# EAGLE schematic Mixer_schaltplan_2.12.23 (EAGLE 9.7.0)
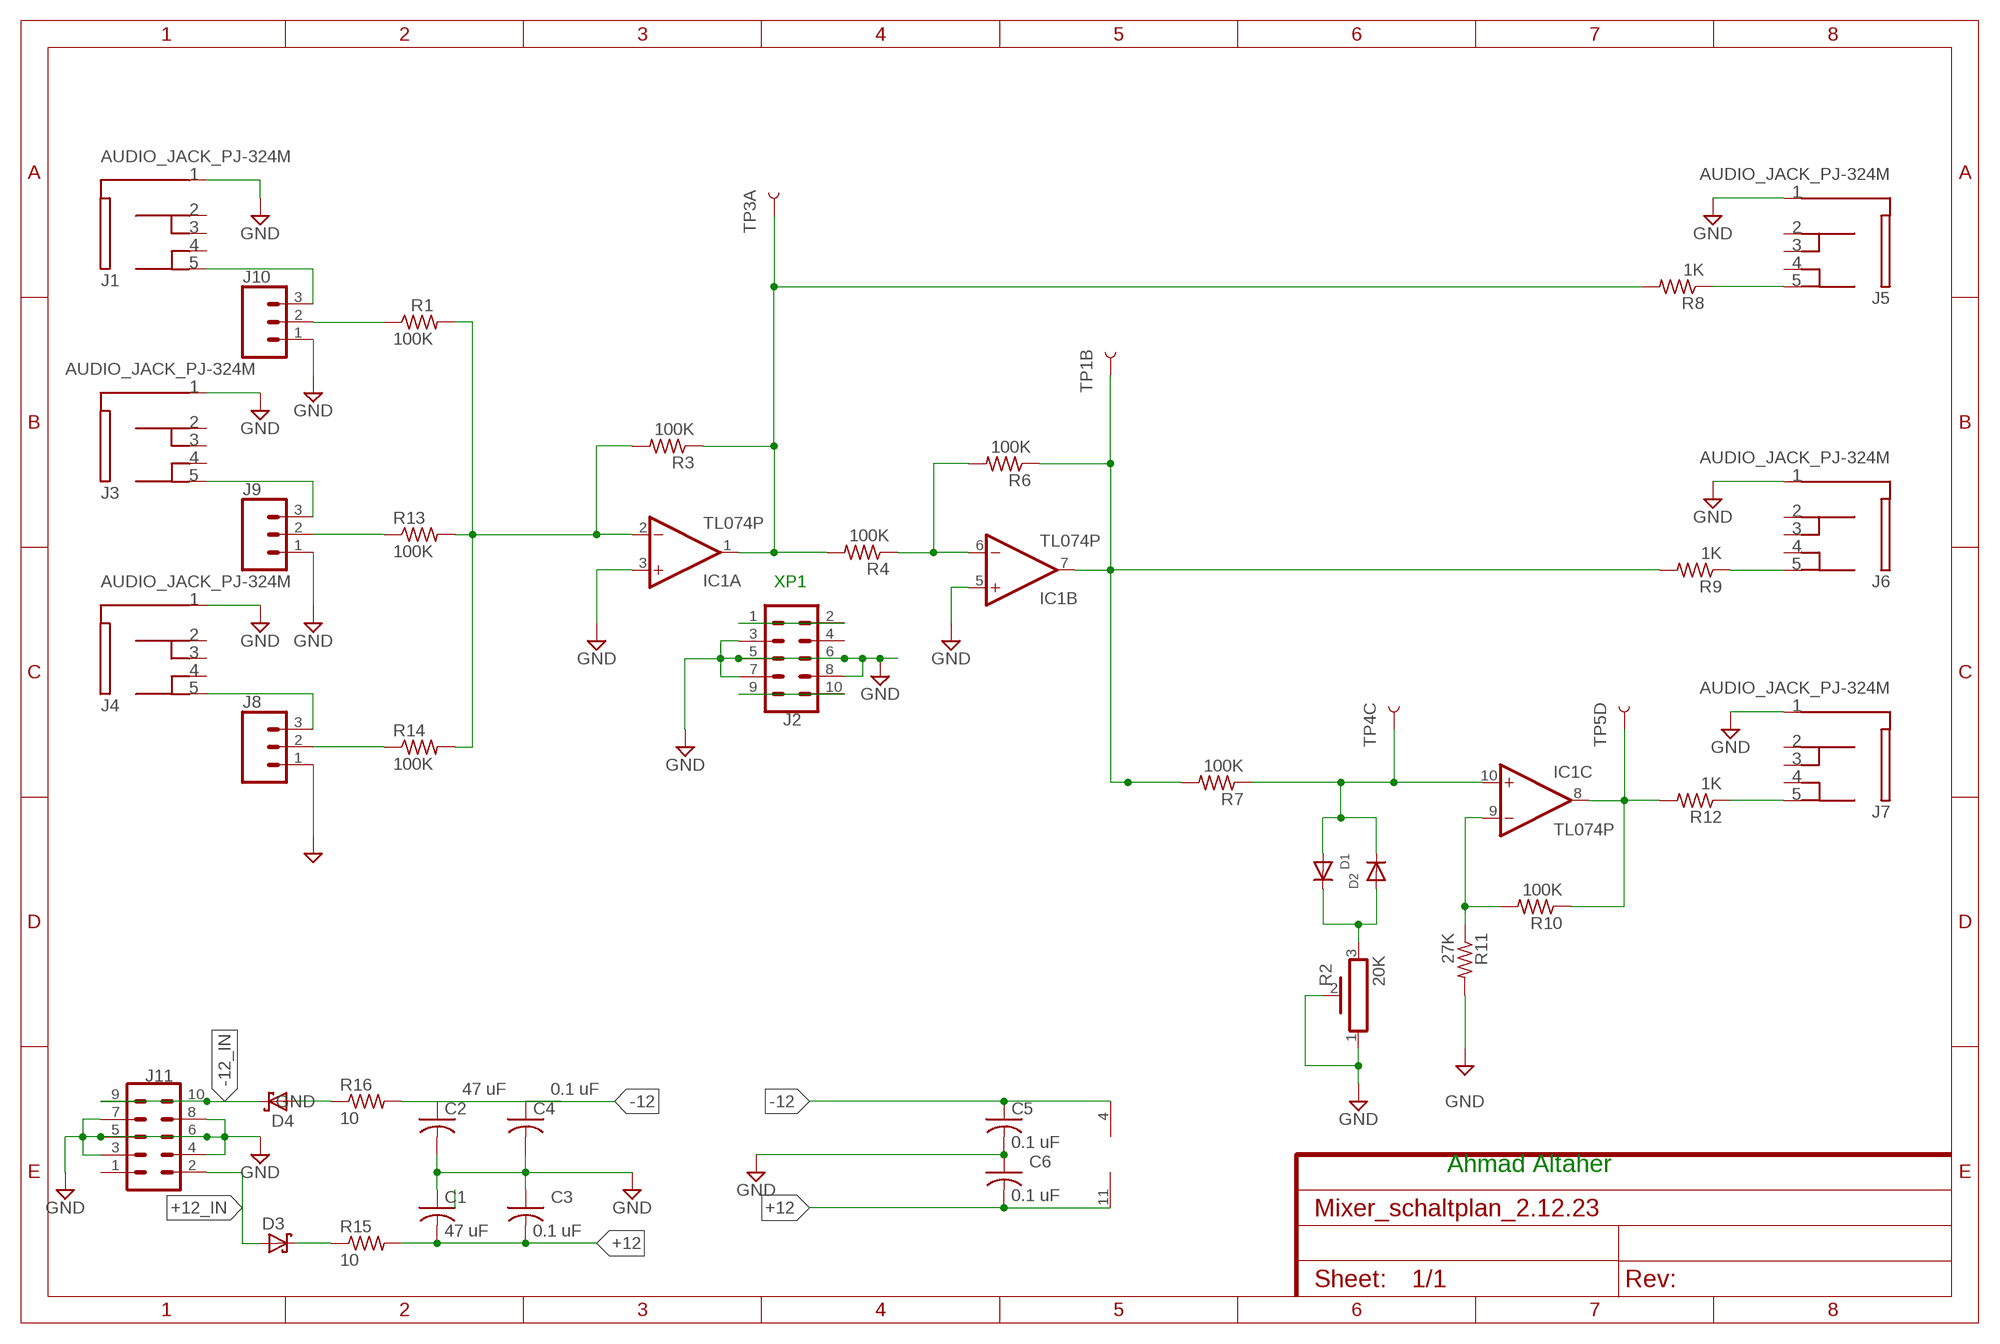
[diagram p0: schematic, sheet 1]

## Parts
C1  47 uF  C-US050-025X075  [C050-025X075]
C2  47 uF  C-US050-025X075  [C050-025X075]
C3  0.1 uF  C-US050-025X075  [C050-025X075]
C4  0.1 uF  C-US050-025X075  [C050-025X075]
C5  0.1 uF  C-US050-025X075  [C050-025X075]
C6  0.1 uF  C-US050-025X075  [C050-025X075]
D1  DIODEDO-1N4148  [DO-1N4148]
D2  DIODEDO-1N4148  [DO-1N4148]
D3  SCHOTTKY-DIODEDO41-7  [DO41-7]
D4  SCHOTTKY-DIODEDO41-7  [DO41-7]
IC1  TL074P  [DIL14]
J1  AUDIO_JACK_PJ-324M  [PJ-324M]
J2  CONN_05X2SHD-NS  [2X5-SHROUDED-NS]
J3  AUDIO_JACK_PJ-324M  [PJ-324M]
J4  AUDIO_JACK_PJ-324M  [PJ-324M]
J5  AUDIO_JACK_PJ-324M  [PJ-324M]
J6  AUDIO_JACK_PJ-324M  [PJ-324M]
J7  AUDIO_JACK_PJ-324M  [PJ-324M]
J8  CONN_03  [1X03]
J9  CONN_03  [1X03]
J10  CONN_03  [1X03]
J11  CONN_05X2SHD-NS  [2X5-SHROUDED-NS]
R1  100K  R-US_0204/7  [0204/7]
R2  20K  PV36W  [PV36W]
R3  100K  R-US_0207/10  [0207/10]
R4  100K  R-US_0207/10  [0207/10]
R6  100K  R-US_0207/10  [0207/10]
R7  100K  R-US_0207/10  [0207/10]
R8  1K  R-US_0204/2V  [0204V]
R9  1K  R-US_0204/2V  [0204V]
R10  100K  R-US_0207/10  [0207/10]
R11  27K  R-US_0207/10  [0207/10]
R12  1K  R-US_0204/2V  [0204V]
R13  100K  R-US_0204/7  [0204/7]
R14  100K  R-US_0204/7  [0204/7]
R15  10  R-US_0204/2V  [0204V]
R16  10  R-US_0204/2V  [0204V]
TP1B  TEST-POINT3X5  [PAD.03X.05]
TP3A  TEST-POINT3X5  [PAD.03X.05]
TP4C  TEST-POINT3X5  [PAD.03X.05]
TP5D  TEST-POINT3X5  [PAD.03X.05]

## Nets
+12: C1.2 C3.2 C5.1 IC1.4(P:V+) R15.2
+12_IN: J2.9 J2.10
-12: C6.2 IC1.11(P:V-) R16.2
-12_IN: D4.C J11.9 J11.10
GND: C1.1 C2.2 C3.1 C4.2 C5.2 C6.1 IC1.3(A:+IN) IC1.5(B:+IN) J1.1 J2.3 J2.5 J2.6 J2.7 J2.8 J3.1 J4.1 J5.1 J6.1 J7.1 J8.1 J9.1 J10.1 J11.3 J11.4 J11.5 J11.6 J11.7 J11.8 R2.1 R2.2 R11.2
N$1: IC1.1(A:OUT) R3.1 R4.2 R8.2 TP3A.P$1
N$2: IC1.6(B:-IN) R4.1 R6.2
N$4: IC1.7(B:OUT) R6.1 R7.2 R9.2 TP1B.P$1
N$5: J1.5 J10.3
N$6: D1.C D2.A R2.3
N$7: D1.A D2.C IC1.10(C:+IN) R7.1 TP4C.P$1
N$8: IC1.9(C:-IN) R10.2 R11.1
N$9: IC1.8(C:OUT) R10.1 R12.2 TP5D.P$1
N$10: J9.2 R13.1
N$11: J8.2 R14.1
N$12: IC1.2(A:-IN) R1.2 R3.2 R13.2 R14.2
N$13: J4.5 J8.3
N$14: J5.5 R8.1
N$15: J3.5 J9.3
N$16: D3.C R15.1
N$17: D4.A R16.1
N$18: J6.5 R9.1
N$19: J7.5 R12.1
N$21: C2.1
N$22: J2.1 J2.2
N$23: C4.1
N$24: D3.A J11.2
TEST: J10.2 R1.1
Unconnected: IC1.12(D:+IN) IC1.13(D:-IN) IC1.14(D:OUT) J1.2 J1.3 J1.4 J2.4 J3.2 J3.3 J3.4 J4.2 J4.3 J4.4 J5.2 J5.3 J5.4 J6.2 J6.3 J6.4 J7.2 J7.3 J7.4 J11.1

## Notes on the sheet
- IN1 | INV OUT
- IN2
- OUT
- IN3
- XP1
- CLIP OUT
- Ahmad Altaher

## Library data of the parts
C1-C6 = adafruit:C-US: CAPACITOR, American symbol
D1 D2 = adafruit:DIODE: Diode SMADIODE - SMA Surface Mount Package 20V 1A Schottky Diode Digikey: 641-1014-6-ND DO-1N4148 - Through Hole Small Current Diode SOD-123 20V 1 A (.5mV Vf) Schottky Diode - Digikey: MBRX120TPMSCT-ND SOD-323 10V 570mA (.38mV Vf, 3ns) Schottky Diode - Digikey: ZLLS410CT-ND SOD-523 30V 30mA Schottky Diode (RB751S-40TE61) - Digikey: RB751S-40TE61CT-ND SOT23-R/W - SOT23 Package (R = Solder Paste/Reflow Ovens, W = Hand-Soldering) BAT54Film 40V 300mA - Digikey: 497-7162-1-ND
D3 D4 = adafruit:SCHOTTKY-DIODE: Schottky Diode
IC1 = linear:TL074: OP AMP
J1 J3-J7 = Synthesizer v25:AUDIO_JACK_PJ-324M: 324M Audio Jack
J2 J11 = SparkFun-Connectors:CONN_05X2: Multi connection point. Often used as Generic Header-pin footprint for 0.1 inch spaced/style header connections For AVR SPI programming port, see special device with nice symbol: "AVR_SPI_PROG_5x2.dev" You can populate with any combo of single row headers, but if you'd like an exact match, check these: 2x5 AVR ICSP Male Header <https://www.sparkfun.com/products/778> (PRT-00778) 2x5 Pin Shrouded Header <https://www.sparkfun.com/products/8506> (PRT-08506) On any of the 0.1 inch spaced packages, you can populate with these: Break Away Headers - Straight <https://www.sparkfun.com/products/116> (PRT-00116) Break Away Male Headers - Right Angle <https://www.sparkfun.com/products/553> (PRT-00553) Female Headers <https://www.sparkfun.com/products/115> (PRT-00115) Break Away Headers - Machine Pin <https://www.sparkfun.com/products/117> (PRT-00117) Break Away Female Headers - Swiss Machine Pin <https://www.sparkfun.com/products/743> (PRT-00743) Special note: the shrouded connector mates well with our 5x2 ribbon cables: 2x5 Pin IDC Ribbon Cable <https://www.sparkfun.com/products/8535> (PRT-08535); PROD_ID: CONN-08671; SF_ID: PRT-08506
J8-J10 = SparkFun-Connectors:CONN_03: Multi connection point. Often used as Generic Header-pin footprint for 0.1 inch spaced/style header connections On any of the 0.1 inch spaced packages, you can populate with these: Break Away Headers - Straight <https://www.sparkfun.com/products/116> (PRT-00116) Break Away Male Headers - Right Angle <https://www.sparkfun.com/products/553> (PRT-00553) Female Headers <https://www.sparkfun.com/products/115> (PRT-00115) Break Away Headers - Machine Pin <https://www.sparkfun.com/products/117> (PRT-00117) Break Away Female Headers - Swiss Machine Pin <https://www.sparkfun.com/products/743> (PRT-00743) Stackable Header - 3 Pin (Female, 0.1") <https://www.sparkfun.com/products/13875> (PRT-13875) For SCREWTERMINALS and SPRING TERMINALS visit here: Screw Terimnals on SparkFun.com <https://www.sparkfun.com/search/results?term=Screw+Terminals> (5mm/3.5mm/2.54mm spacing) This device is also useful as a general connection point to wire up your design to another part of your project. Our various solder wires solder well into these plated through hole pads. Hook-Up Wire - Assortment (Stranded, 22 AWG) <https://www.sparkfun.com/products/11375> (PRT-11375) Hook-Up Wire - Assortment (Solid Core, 22 AWG) <https://www.sparkfun.com/products/11367> (PRT-11367) View the entire wire category on our website here <https://www.sparkfun.com/categories/141> Special notes: Molex polarized connector foot print use with SKU : PRT-08232 with associated crimp pins and housings.
R1 R3 R4 R6-R16 = adafruit:R-US_: RESISTOR, American symbol
R2 = Resistor:PV36: Rectangular Trimmer Potentiometers - PV36 Series Datasheet <https://www.bourns.com/docs/Product-Datasheets/pv36.pdf>; CATEGORY: Resistor; DESCRIPTION: Lead Sealed Type Multiturn PV36 Series; MANUFACTURER: BOURNS; MPN: PV36W; OPERATING_TEMPERATURE: -55 to +125 °C; PART_STATUS: Active; ROHS_COMPLIANCE: RoHS Compliant; SERIES: PV36; SUB-CATEGORY: Trimpot; TYPE: Lead Sealed
TP1B TP3A TP4C TP5D = SparkFun-Connectors:TEST-POINT: SparkFun Test Points Bare copper test points for troubleshooting or In-Circuit-Testing. These are used by our Production team for verifying production board runs using pogo-pins on test beds. SparkFun Products: SparkFun LSM9DS1 Breakout <https://www.sparkfun.com/products/13284> SparkFun PSOC <https://www.sparkfun.com/products/13714> SparkFun Load Cell Amplifier <https://www.sparkfun.com/products/13879>